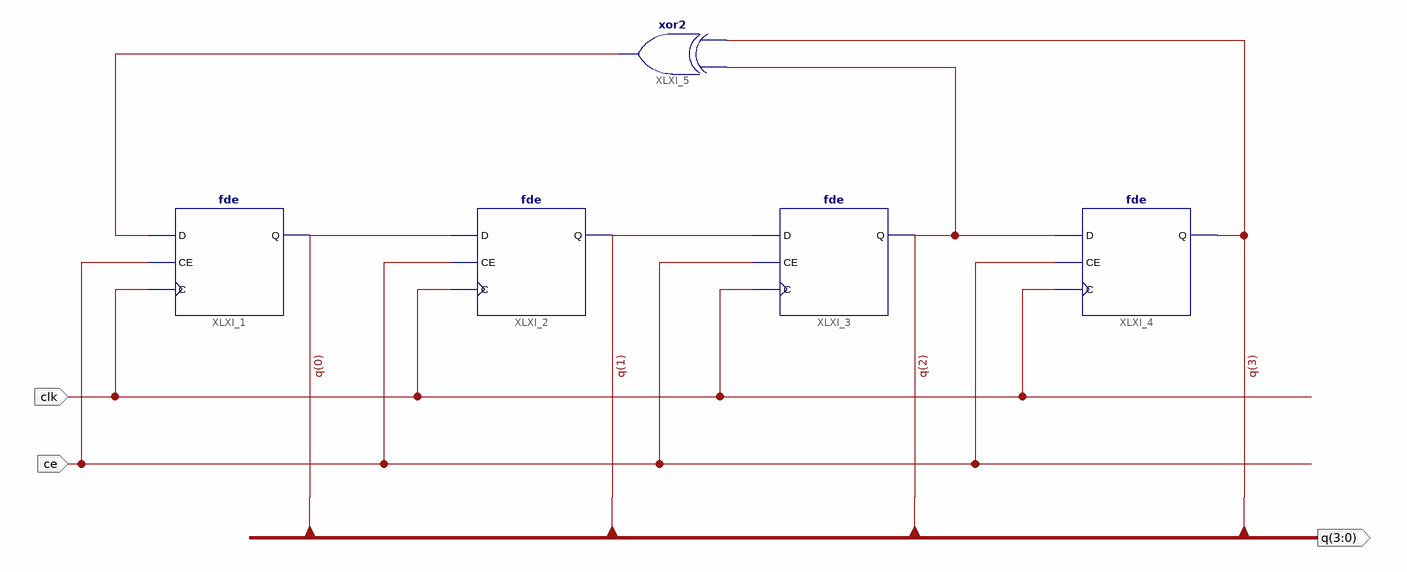
[diagram p0: schematic sheet 1]
// Xilinx ISE schematic rdm.sch (spartan6) as structural Verilog: 5 symbols, 3 ports
module rdm (
  input  clk,
  input  ce,
  output [3:0] q
);

  wire XLXN_17;

  fde #(.INIT("1")) XLXI_1 (.C(clk), .CE(ce), .D(XLXN_17), .Q(q[0]));
  fde XLXI_2 (.C(clk), .CE(ce), .D(q[0]), .Q(q[1]));
  fde XLXI_3 (.C(clk), .CE(ce), .D(q[1]), .Q(q[2]));
  fde XLXI_4 (.C(clk), .CE(ce), .D(q[2]), .Q(q[3]));
  xor XLXI_5 (XLXN_17, q[2], q[3]);
endmodule
